# EAGLE design Full Sonar v1 opt corrected external clock (EAGLE 7.4.0)
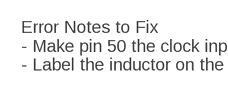
[diagram p0: schematic, sheet 1, part 1 of 2]
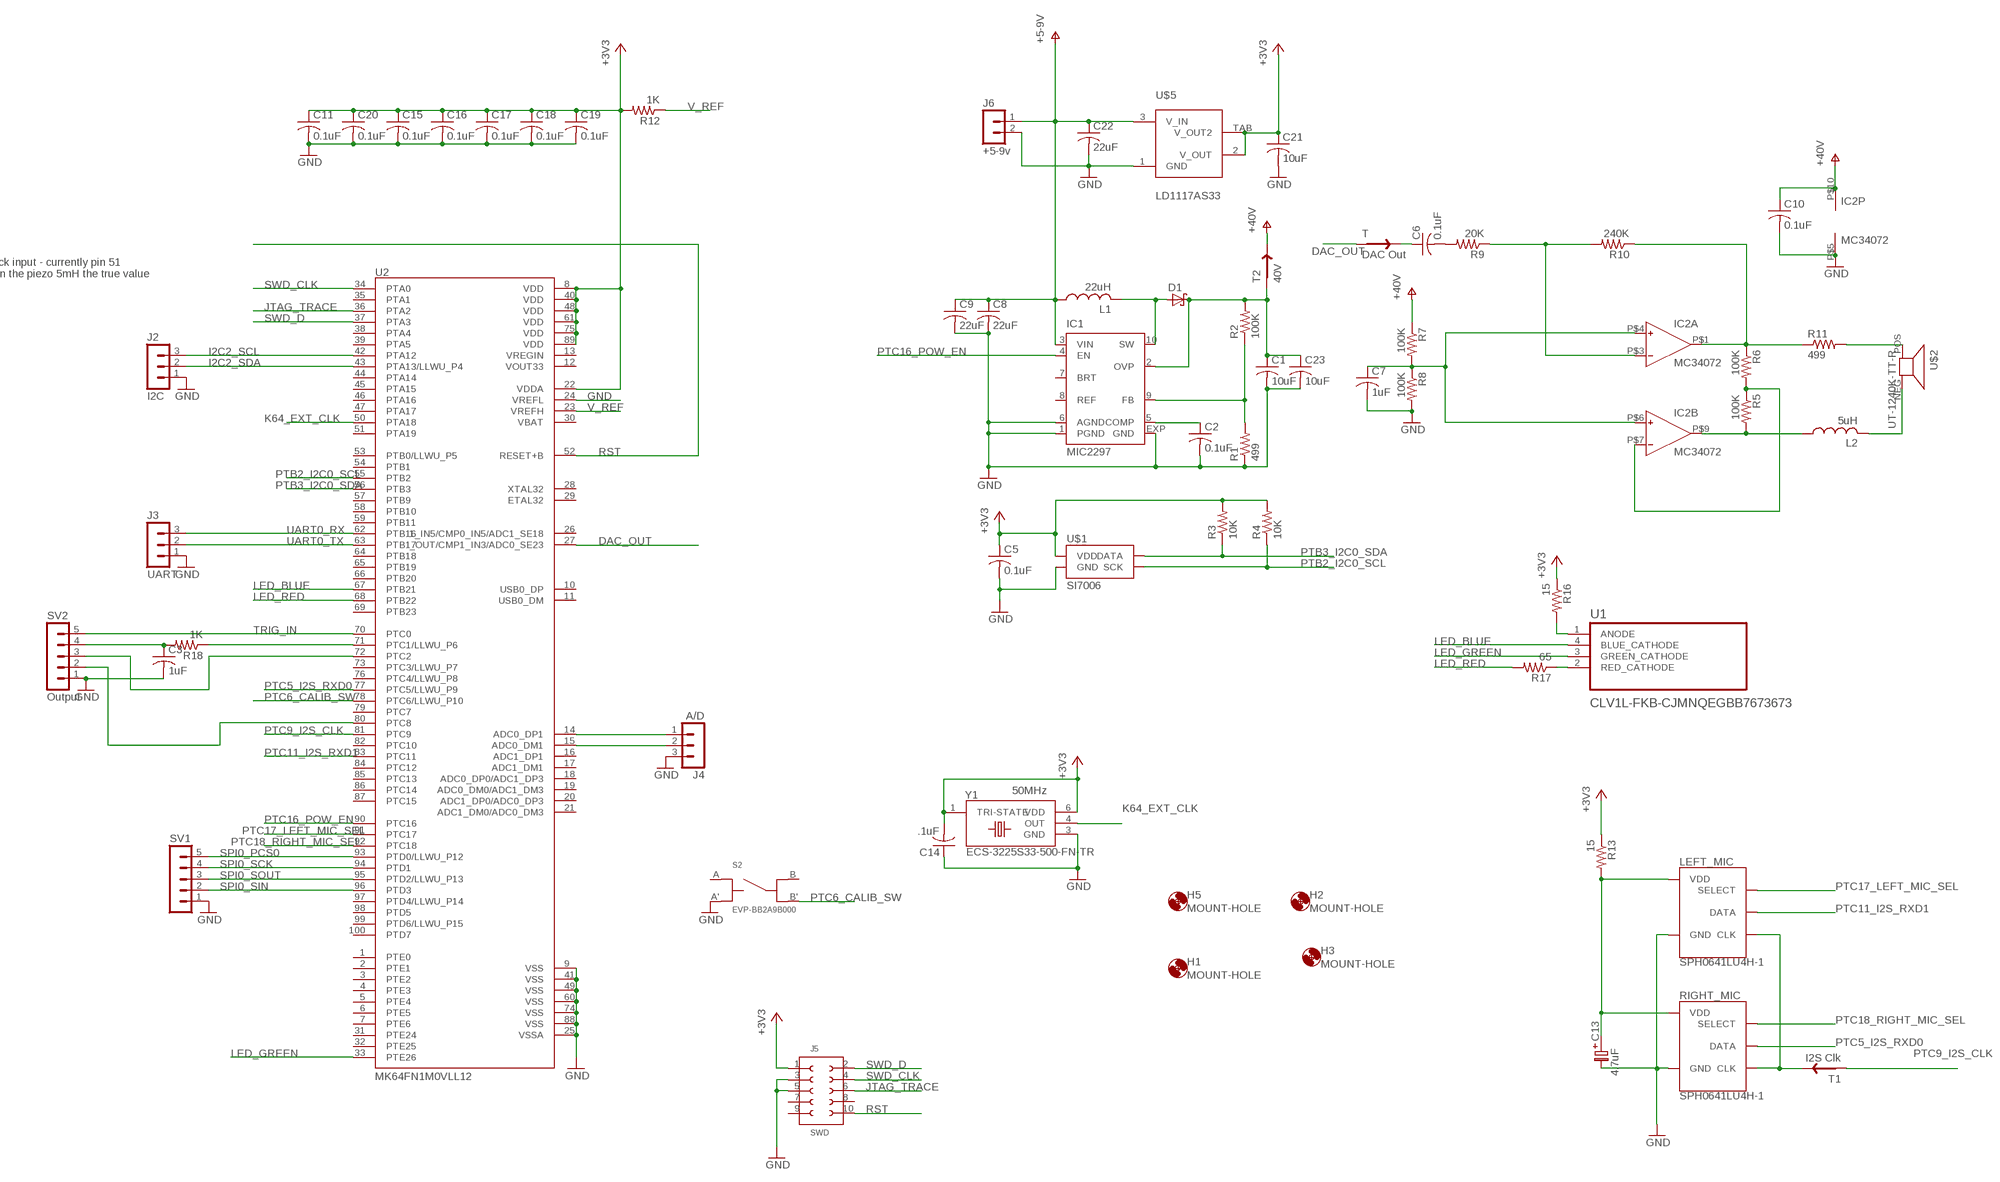
[diagram p1: schematic, sheet 1, part 2 of 2]

## Parts
C1  10uF  C-USC1206  [C1206]
C2  0.1uF  C-USC0603  [C0603]
C3  1uF  C-USC0603  [C0603]
C5  0.1uF  C-USC0603  [C0603]
C6  0.1uF  C-USC0603  [C0603]
C7  1uF  C-USC0603  [C0603]
C8  22uF  C-USC0805  [C0805]
C9  22uF  C-USC0805  [C0805]
C10  0.1uF  C-USC0603  [C0603]
C11  0.1uF  C-USC0603  [C0603]
C13  4.7uF  CPOLA  [TE-A-3216]
C14  .1uF  C-USC0603  [C0603]
C15  0.1uF  C-USC0603K  [C0603K]
C16  0.1uF  C-USC0603  [C0603]
C17  0.1uF  C-USC0603  [C0603]
C18  0.1uF  C-USC0603  [C0603]
C19  0.1uF  C-USC0603  [C0603]
C20  0.1uF  C-USC0603K  [C0603K]
C21  10uF  C-USC0603  [C0603]
C22  22uF  C-USC0805  [C0805]
C23  10uF  C-USC1206  [C1206]
D1  DIODE_SCHOTTKYMICROSMP  [DIODE_SCHOTTKY_MICROSMP]
H1  MOUNT-HOLE  [SCREWHOLE2-56]
H2  MOUNT-HOLE  [SCREWHOLE2-56]
H3  MOUNT-HOLE  [SCREWHOLE2-56]
H5  MOUNT-HOLE  [SCREWHOLE2-56]
IC1  MIC2297  [MLF10]
IC2  MC34072  [WQFN10]
J2  I2C  MA03-1  [MA03-1]
J3  UART  MA03-1  [MA03-1]
J4  A/D  MA03-1  [MA03-1]
J5  SWD  62201021121  [62201021121]
J6  +5-9v  MA02-1  [MA02-1]
L1  22uH  INDUCTOR7  [INDUCTOR_BOURNS_SRN3012TA]
L2  5uH  INDUCTOR  [INDUCTOR_BOURNS_SDR0503]
LEFT_MIC  SPH0641LU4H-1  [SPH0641LU4H-1]
R1  499  R-US_R0603  [R0603]
R2  100K  R-US_R0603  [R0603]
R3  10K  R-US_R0603  [R0603]
R4  10K  R-US_R0603  [R0603]
R5  100K  R-US_R0603  [R0603]
R6  100K  R-US_R0603  [R0603]
R7  100K  R-US_R0603  [R0603]
R8  100K  R-US_R0603  [R0603]
R9  20K  R-US_R0603  [R0603]
R10  240K  R-US_R0603  [R0603]
R11  499  R-US_R0603  [R0603]
R12  1K  R-US_R0603  [R0603]
R13  15  R-US_R0603  [R0603]
R16  15  R-US_R0603  [R0603]
R17  65  R-US_R0603  [R0603]
R18  1K  R-US_R0603  [R0603]
RIGHT_MIC  SPH0641LU4H-1  [SPH0641LU4H-1]
S2  EVP-BB2A9B000  [SW_EVP-BB2A9B000]
SV1  MA05-1  [MA05-1]
SV2  Output  MA05-1  [MA05-1]
T  DAC Out  TESTPAD""  [TESTPAD]
T1  I2S Clk  TESTPAD""  [TESTPAD]
T2  40V  TESTPAD""  [TESTPAD]
U1  CLV1L-FKB-CJMNQEGBB7673673  [SOJ150P350X372-4N]
U2  MK64FN1M0VLL12  [QFP50P1600X1600X170-100N]
U$1  SI7006  [SI7006]
U$2  UT-1240K-TT-R  [UT-1240K-TT-R]
U$5  LD1117AS33  [SOT223]
Y1  ECS-3225S33-500-FN-TR  [XTAL_ECS-3225S18-050-EN-TR]

## Nets
+3V3: C5.1 C11.1 C14.2 C15.1 C16.1 C17.1 C18.1 C19.1 C20.1 C21.1 J5.1 R3.2 R4.2 R12.2 R13.1 R16.1 U2.8(VDD) U2.22(VDDA) U2.40(VDD) U2.48(VDD) U2.61(VDD) U2.75(VDD) U2.89(VDD) U$1.VDD U$5.2(V_OUT) U$5.TAB(V_OUT2) Y1.1(TRI-STATE) Y1.6(VDD)
+5-9V: C8.1 C9.1 C22.1 IC1.3(VIN) J6.1 L1.P$1 U$5.3(V_IN)
+40V: C1.1 C23.1 D1.C IC1.2(OVP) R2.2 T2.IN
DAC_OUT: T.IN U2.27(_OUT/CMP1_IN3/ADC0_SE23)
GND: C1.2 C2.2 C3.2 C5.2 C7.2 C8.2 C9.2 C10.2 C11.2 C13.- C14.1 C15.2 C16.2 C17.2 C18.2 C19.2 C20.2 C21.2 C22.2 C23.2 IC1.1(PGND) IC1.6(AGND) IC1.EXP(GND) IC2.P$5(P:V-) J2.1 J3.1 J4.3 J5.3 J5.5 J6.2 LEFT_MIC.3(GND) R1.1 R8.2 RIGHT_MIC.3(GND) S2.A' SV1.1 SV2.1 U2.9(VSS) U2.24(VREFL) U2.25(VSSA) U2.41(VSS) U2.49(VSS) U2.60(VSS) U2.74(VSS) U2.88(VSS) U$1.GND U$5.1(GND) Y1.3(GND)
I2C2_SCL: J2.3 U2.42(PTA12)
I2C2_SDA: J2.2 U2.43(PTA13/LLWU_P4)
JTAG_TRACE: J5.6 U2.36(PTA2)
K64_EXT_CLK: U2.50(PTA18) Y1.4(OUT)
LED_BLUE: U1.4(BLUE_CATHODE) U2.67(PTB21)
LED_GREEN: U1.3(GREEN_CATHODE) U2.33(PTE26)
LED_RED: R17.2 U2.68(PTB22)
N$1: J4.1 U2.14(ADC0_DP1)
N$2: D1.A IC1.10(SW) L1.P$2
N$3: J4.2 U2.15(ADC0_DM1)
N$4: R16.2 U1.1(ANODE)
N$5: C2.1 IC1.5(COMP)
N$6: IC2.P$9(B:OUT) L2.1 R5.2
N$7: IC2.P$7(B:IN-) R5.1 R6.2
N$8: IC2.P$1(A:OUT) R6.1 R10.1 R11.1
N$9: IC1.9(FB) R1.2 R2.1
N$10: R11.2 U$2.POS
N$11: C7.1 IC2.P$4(A:IN+) IC2.P$6(B:IN+) R7.2 R8.1
N$12: IC2.P$3(A:IN-) R9.1 R10.2
N$13: C6.2 R9.2
N$14: L2.2 U$2.NEG
N$15: C6.1 T.OUT
N$17: LEFT_MIC.4(CLK) RIGHT_MIC.4(CLK) T1.OUT
N$18: C13.+ LEFT_MIC.5(VDD) R13.2 RIGHT_MIC.5(VDD)
N$20: R17.1 U1.2(RED_CATHODE)
N$21: R18.1 U2.71(PTC1/LLWU_P6)
N$22: C3.1 R18.2 SV2.4
N$23: SV2.3 U2.72(PTC2)
N$24: SV2.2 U2.80(PTC8)
PTB2_I2C0_SCL: R4.1 U2.55(PTB2) U$1.SCK
PTB3_I2C0_SDA: R3.1 U2.56(PTB3) U$1.DATA
PTC5_I2S_RXD0: RIGHT_MIC.1(DATA) U2.77(PTC5/LLWU_P9)
PTC6_CALIB_SW: S2.B' U2.78(PTC6/LLWU_P10)
PTC9_I2S_CLK: T1.IN U2.81(PTC9)
PTC11_I2S_RXD1: LEFT_MIC.1(DATA) U2.83(PTC11)
PTC16_POW_EN: IC1.4(EN) U2.90(PTC16)
PTC17_LEFT_MIC_SEL: LEFT_MIC.2(SELECT) U2.91(PTC17)
PTC18_RIGHT_MIC_SEL: RIGHT_MIC.2(SELECT) U2.92(PTC18)
RST: J5.10 U2.52(RESET+B)
SPI0_PCS0: SV1.5 U2.93(PTD0/LLWU_P12)
SPI0_SCK: SV1.4 U2.94(PTD1)
SPI0_SIN: SV1.2 U2.96(PTD3)
SPI0_SOUT: SV1.3 U2.95(PTD2/LLWU_P13)
SWD_CLK: J5.4 U2.34(PTA0)
SWD_D: J5.2 U2.37(PTA3)
TRIG_IN: SV2.5 U2.70(PTC0)
UART0_RX: J3.3 U2.62(PTB16)
UART0_TX: J3.2 U2.63(PTB17)
V+: C10.1 IC2.P$10(P:V+) R7.1 T2.OUT ; supply symbol labelled +40V
V_REF: R12.1 U2.23(VREFH)
Unconnected: IC1.7(BRT) IC1.8(REF) J5.7 J5.8 J5.9 S2.A S2.B U2.1(PTE0) U2.2(PTE1) U2.3(PTE2) U2.4(PTE3) U2.5(PTE4) U2.6(PTE5) U2.7(PTE6) U2.10(USB0_DP) U2.11(USB0_DM) U2.16(ADC1_DP1) U2.17(ADC1_DM1) U2.18(ADC0_DP0/ADC1_DP3) U2.19(ADC0_DM0/ADC1_DM3) U2.20(ADC1_DP0/ADC0_DP3) U2.21(ADC1_DM0/ADC0_DM3) U2.26(1_IN5/CMP0_IN5/ADC1_SE18) U2.28(XTAL32) U2.29(ETAL32) U2.31(PTE24) U2.32(PTE25) U2.35(PTA1) U2.38(PTA4) U2.39(PTA5) U2.44(PTA14) U2.45(PTA15) U2.46(PTA16) U2.47(PTA17) U2.51(PTA19) U2.53(PTB0/LLWU_P5) U2.54(PTB1) U2.57(PTB9) U2.58(PTB10) U2.59(PTB11) U2.64(PTB18) U2.65(PTB19) U2.66(PTB20) U2.69(PTB23) U2.73(PTC3/LLWU_P7) U2.76(PTC4/LLWU_P8) U2.79(PTC7) U2.82(PTC10) U2.84(PTC12) U2.85(PTC13) U2.86(PTC14) U2.87(PTC15) U2.97(PTD4/LLWU_P14) U2.98(PTD5) U2.99(PTD6/LLWU_P15) U2.100(PTD7)

## Notes on the sheet
- Error Notes to Fix
  - Make pin 50 the clock input - currently pin 51
  - Label the inductor on the piezo 5mH the true value
- 50MHz

## Power pins joined to a net without a drawn wire
VBAT: U2.30(VBAT)
VOUT33: U2.12(VOUT33)
VREGIN: U2.13(VREGIN)

## Library data of the parts
C1-C3 C5-C11 C14-C23 = rcl:C-US: CAPACITOR, American symbol
C13 = filip:CPOL: polarized SMD caps Size A 3.2x1.6, Size B 3.5x2.8, Size C 6.0x3.2, Size D (or N) 7.3x4.3 0805 United Chem E60 5x5.7, F60 6.3x5.7, H70 8x6.7 or HA0
D1 = filip:DIODE_SCHOTTKY: Schottky Power Rectifier
H1-H3 H5 = filip:MOUNT-HOLE: MOUNTING HOLE with drill center marker
IC1 = micrel:MIC2297: 40V PWM Boost Regulator White LED Driver Source: http://www.micrel.com/_PDF/mic2297.pdf; MPN: MIC2297-38YML TR; OC_FARNELL: 1663107; OC_NEWARK: 11R3489
IC2 = filip:MC34072: Dual Precision, Low Cost, High Speed Op Amp +44v supply
J2-J4 = filip:MA03-1: PIN HEADER; OC_FARNELL: unknown; OC_NEWARK: unknown
J5 = pin header 1.27 pitch 2 row 10 pin:62201021121: WR-PHD 1.27mm Dual Pin Header, 10 Pins=>Code : Con_BTB_PHD_1.27_2_62201021121 <http://katalog.we-online.de/media/thumbs2/eican/thb_Con_BTB_PHD_1.27_2_6220xx21121_pf2.jpg> Details see: http://katalog.we-online.de/en/em/622_0xx_211_21 Created 2014-06-03, Karrer Zheng 2014 (C) Würth Elektronik; AVAILABILITY: Good; DESCRIPTION: CONN HEADER VERT DUAL 10POS 1.27; MF: Würth Elektronik; MP: 62201021121; PACKAGE: None; PRICE: 0.94 USD
J6 = filip:MA02-1
L1 L2 = filip:INDUCTOR
LEFT_MIC RIGHT_MIC = filip:SPH0641LU4H-1: Knowles MEMS microphone - ultrasonic range
R1-R13 R16-R18 = rcl:R-US_: RESISTOR, American symbol
S2 = EVP-BB2A9B000:EVP-BB2A9B000: SWITCH TACTILE SPST-NO 0.02A 15V; AVAILABILITY: Good; DESCRIPTION: SWITCH TACTILE SPST-NO 0.02A 15V; MF: Panasonic Electronic; MP: EVP-BB2A9B000; PACKAGE: None; PRICE: 0.40 USD
SV1 SV2 = con-lstb:MA05-1: PIN HEADER; OC_FARNELL: unknown; OC_NEWARK: unknown
T T1 T2 = filip:TESTPAD
U1 = CLV1L-FKB-CJMNQEGBB7673673:CLV1L-FKB-CJMNQEGBB7673673: None; AVAILABILITY: Good; DESCRIPTION: LED RGB 4PLCC SMD; MF: Cree; MP: CLV1L-FKB-CJMNQEGBB7673673; PACKAGE: PLCC-4 Cree; PRICE: 0.22 USD
U2 = MK64FN1M0VLL12:MK64FN1M0VLL12: MCU 32-Bit K64F ARM Cortex M4 RISC 1MB Flash 1.8V/2.5V/3.3V 100-Pin LQFP Tray; AVAILABILITY: Unavailable; DESCRIPTION: IC MCU 32BIT 1MB FLASH 100LQFP; MF: NXP Semiconductors; MP: MK64FN1M0VLL12; PACKAGE: LQFP-100 NXP Semiconductors; PRICE: 10.49 USD
U$1 = filip:SI7006: The Si7006 is an I2C Humidity and Temperature Sensor; PROD_ID: IC-13093
U$2 = filip:UT-1240K-TT-R
U$5 = LD1117AS33:LD1117AS33; AVAILABILITY: Unavailable; DESCRIPTION: Power Management, pin, Linear Regulators, regulator, sot, Semiconductors and Actives; MF: STMicroelectronics; MP: LD1117AS33; PACKAGE: None; PRICE: None
Y1 = ECS-3225S33-500-FN-TR:ECS-3225S33-500-FN-TR: Miniature SMD HCMOS tight stability crystal oscillator; DESCRIPTION: OSC XO 50.0000MHZ HCMOS SMD; DIGI-KEY_PART_NUMBER: XC2226CT-ND; DIGI-KEY_PURCHASE_URL: https://www.digikey.com/product-detail/en/ecs-inc/ECS-3225S33-500-FN-TR/XC2226CT-ND/6578533?WT.z_cid=ref_snapeda&utm_source=snapeda&utm_medium=aggregator&utm_campaign=buynow; MF: ECS International; MP: ECS-3225S33-500-FN-TR; PACKAGE: SMD-6 ECS International

## Board
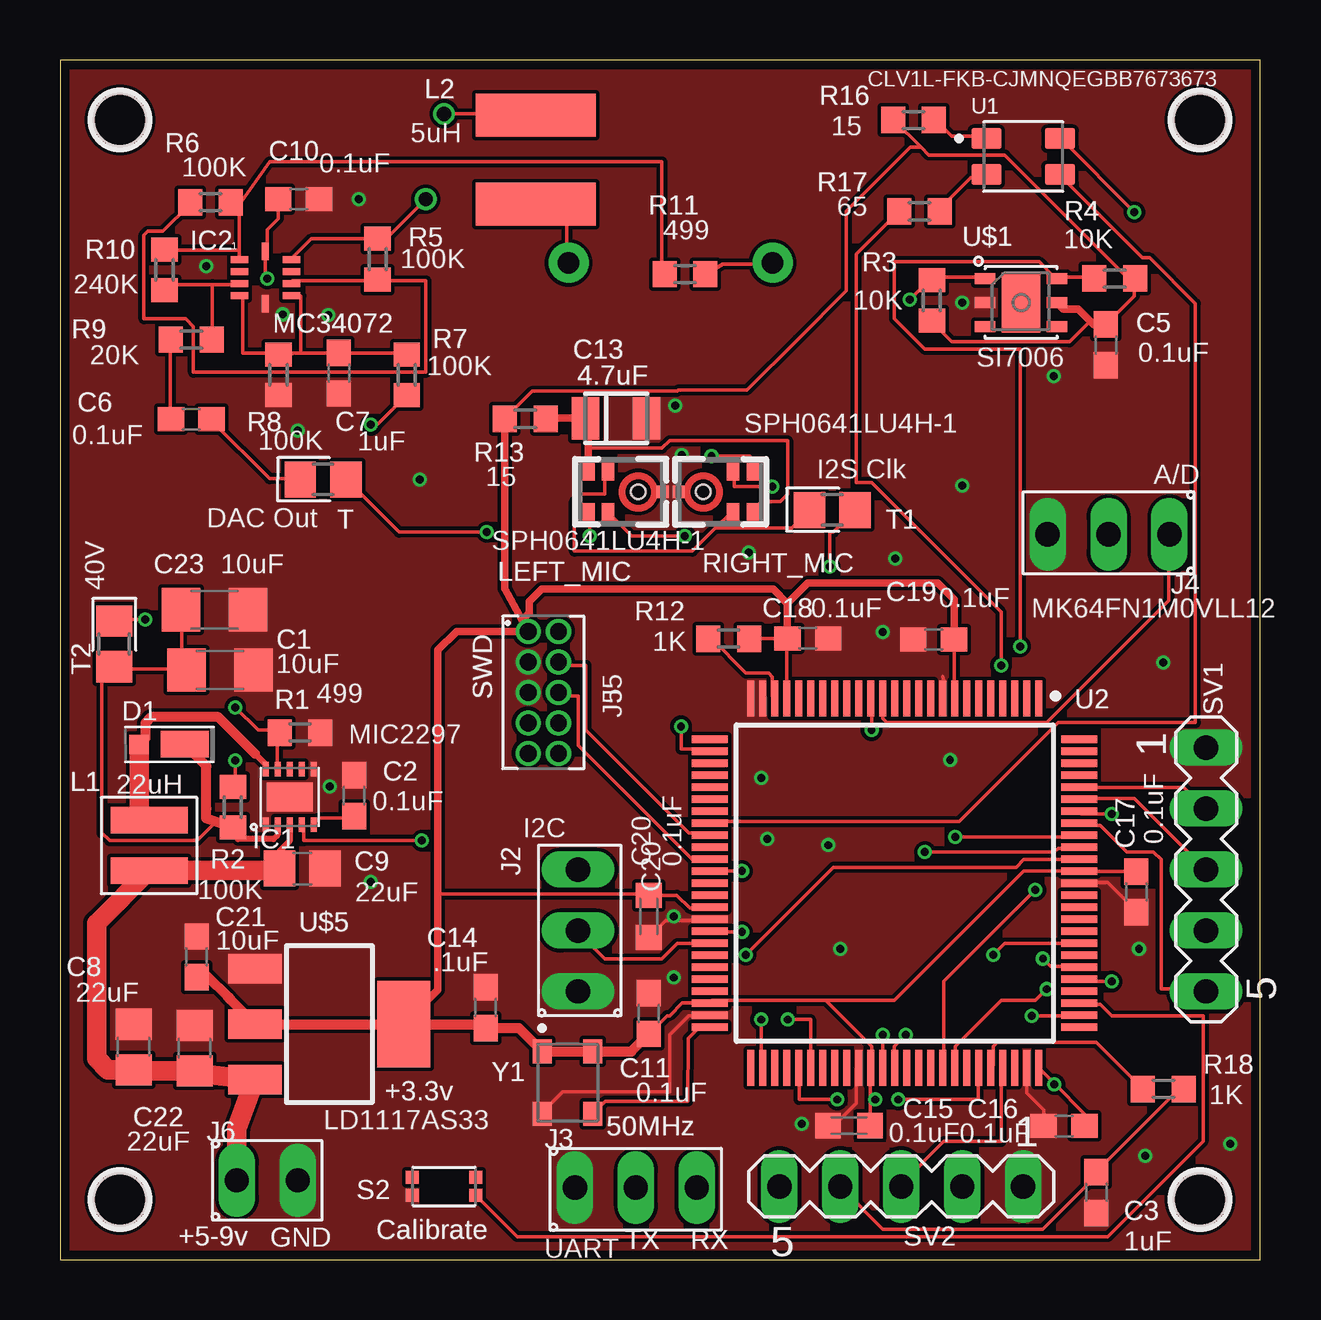
[diagram p2: board, top side]
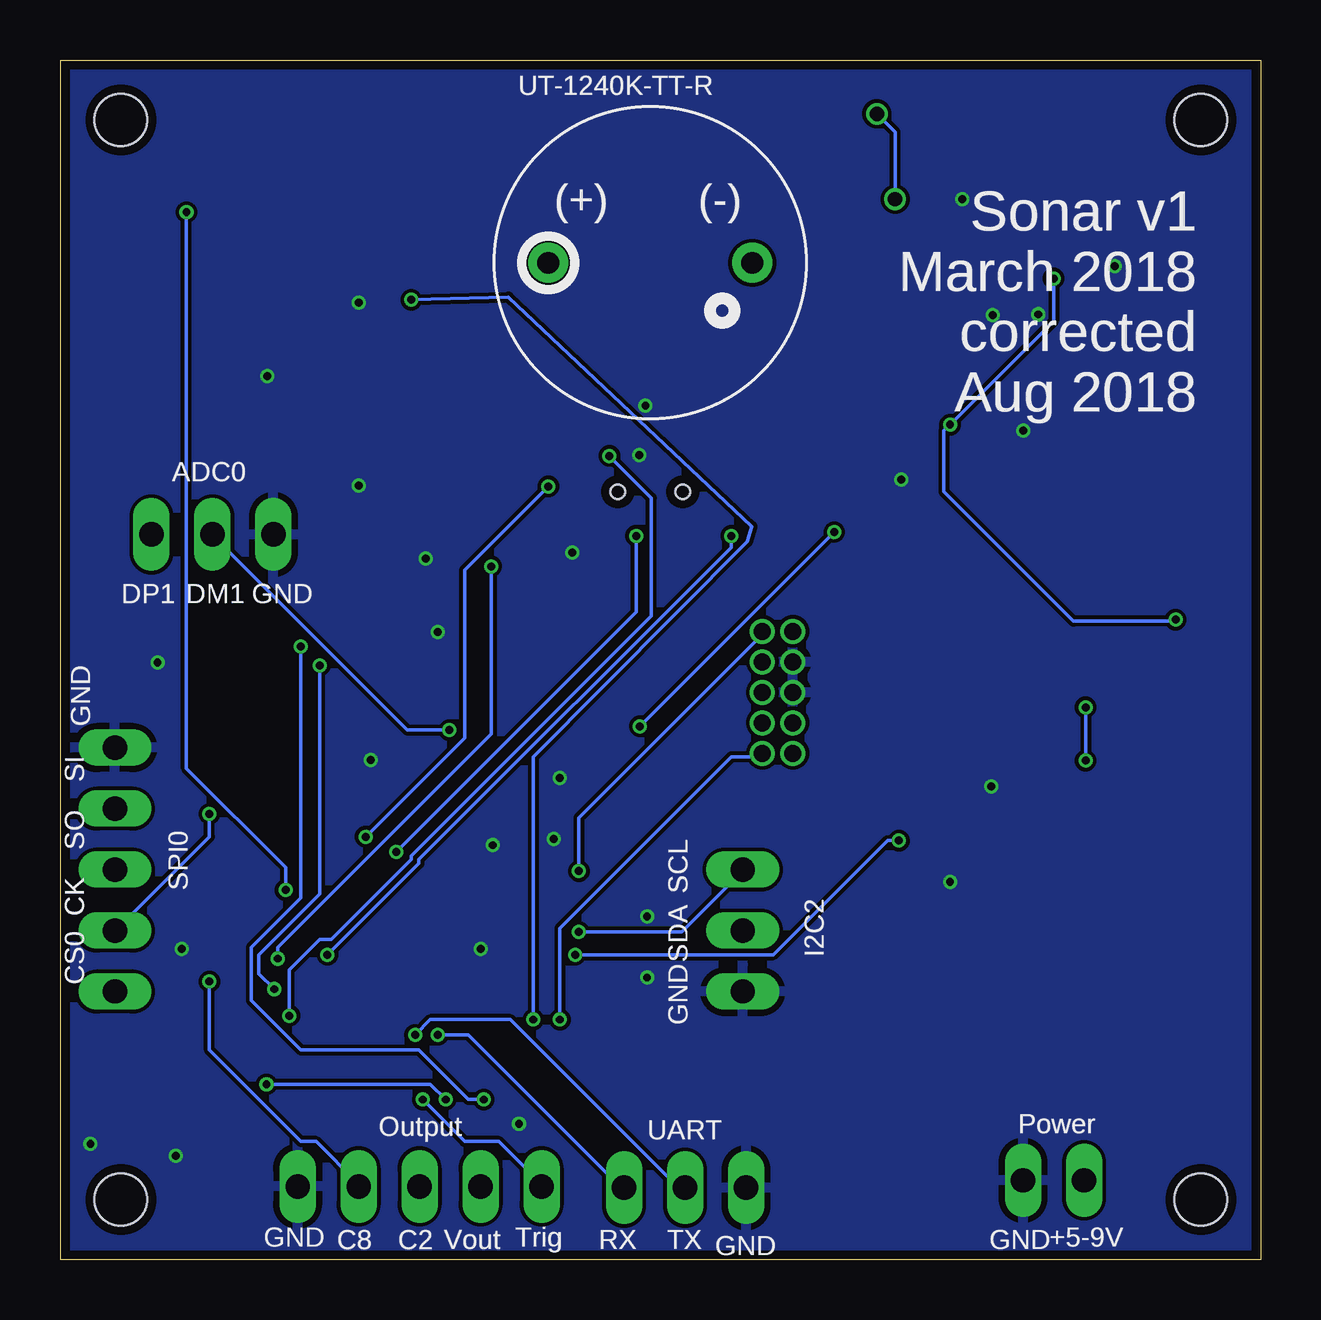
[diagram p3: board, bottom side, seen from below]

Size 50 x 50 mm. Coordinates in mm from the lower left corner, seen from the top.
Outline: 0,0 50,0 50,50 0,50 0,0
Copper layers (1*16): Top 0.035559375mm / dielectric 1.6mm / Bottom 0.035559375mm
Design rules "oshpark-2layer": minimum track width 6mil, minimum drill 10mil, track to track 6mil, track to pad 6mil, pad to pad 6mil, via to via 6mil, smd to smd 6mil, copper to edge 15mil, drill to drill 6mil, minimum pad ring 5mil, minimum via ring 5mil, stop-mask expansion 2.5mil, vias tented up to drill 0mil, thermal gap 10mil

### Footprints (pad centres in the part's own frame; a part is rotated, then mirrored left to right if it is on the bottom)
C1206 = smd 1.6 x 1.8: 1 -1.4,0; 2 1.4,0
C0603 = smd 1.1 x 1: 1 -0.85,0; 2 0.85,0
C0805 = smd 1.3 x 1.5: 1 -0.95,0; 2 0.95,0
TE-A-3216 = smd 1.143 x 1.778: + 1.27,0; - -1.27,0
C0603K = smd 1.05 x 1.08: 1 -0.875,0; 2 0.875,0
DIODE_SCHOTTKY_MICROSMP = smd 0.8 x 0.8: A 0.4,0 | smd 2 x 1.1: C -1.5,0
SCREWHOLE2-56 = hole 2.184: 0,0
MLF10 = smd 0.6 x 0.25: 1 -1.15,1; 2 -1.15,0.5; 3 -1.15,0; 4 -1.15,-0.5; 5 -1.15,-1; 6 1.15,-1; 7 1.15,-0.5; 8 1.15,0; 9 1.15,0.5; 10 1.15,1 | smd 1.2 x 1.9: EXP 0,0
WQFN10 = smd 0.73 x 0.3: P$1 -1.085,0.75; P$2 -1.085,0.25; P$3 -1.085,-0.25; P$4 -1.085,-0.75; P$6 1.085,-0.75; P$7 1.085,-0.25; P$8 1.085,0.25; P$9 1.085,0.75 | smd 0.3 x 0.73: P$5 0,-1.085; P$10 0,1.085
MA03-1 = drill 1.016 long: 1 -2.54,0; 2 0,0; 3 2.54,0
62201021121 = drill 0.7: 1 -2.54,-0.635; 2 -2.54,0.635; 3 -1.27,-0.635; 4 -1.27,0.635; 5 0,-0.635; 6 0,0.635; 7 1.27,-0.635; 8 1.27,0.635; 9 2.54,-0.635; 10 2.54,0.635
MA02-1 = drill 1.016 long: 1 -2.54,0; 2 0,0
INDUCTOR_BOURNS_SRN3012TA = smd 1.1 x 3.2: P$1 -1.05,0; P$2 1.05,0
INDUCTOR_BOURNS_SDR0503 = smd 1.8 x 5: 1 -1.85,0; 2 1.85,0
SPH0641LU4H-1 = smd 0.725 x 0.522: 1 -0.838,2.074; 2 -0.838,1.252; 4 0.838,1.252; 5 0.838,2.074 | smd 0.508 x 0.508: 3 0,-1.016 | hole 0.6: 0,0
R0603 = smd 1 x 1.1: 1 -0.85,0; 2 0.85,0
SW_EVP-BB2A9B000 = smd 0.55 x 0.55: A -1.325,0.375; A' -1.325,-0.375; B 1.325,0.375; B' 1.325,-0.375
MA05-1 = drill 1.016 long: 1 -5.08,0; 2 -2.54,0; 3 0,0; 4 2.54,0; 5 5.08,0
TESTPAD = smd 1.3 x 1.5: IN -0.944,0.029; OUT 0.956,0.029
SOJ150P350X372-4N = smd 1.26 x 0.89: 1 -1.535,0.75; 2 -1.535,-0.75; 3 1.535,-0.75; 4 1.535,0.75
QFP50P1600X1600X170-100N = smd 1.5 x 0.3: 1 -7.7,6; 2 -7.7,5.5; 3 -7.7,5; 4 -7.7,4.5; 5 -7.7,4; 6 -7.7,3.5; 7 -7.7,3; 8 -7.7,2.5; 9 -7.7,2; 10 -7.7,1.5; 11 -7.7,1; 12 -7.7,0.5; 13 -7.7,0; 14 -7.7,-0.5; 15 -7.7,-1; 16 -7.7,-1.5; 17 -7.7,-2; 18 -7.7,-2.5; 19 -7.7,-3; 20 -7.7,-3.5; 21 -7.7,-4; 22 -7.7,-4.5; 23 -7.7,-5; 24 -7.7,-5.5; 25 -7.7,-6; 51 7.7,-6; 52 7.7,-5.5; 53 7.7,-5; 54 7.7,-4.5; 55 7.7,-4; 56 7.7,-3.5; 57 7.7,-3; 58 7.7,-2.5; 59 7.7,-2; 60 7.7,-1.5; 61 7.7,-1; 62 7.7,-0.5; 63 7.7,0; 64 7.7,0.5; 65 7.7,1; 66 7.7,1.5; 67 7.7,2; 68 7.7,2.5; 69 7.7,3; 70 7.7,3.5; 71 7.7,4; 72 7.7,4.5; 73 7.7,5; 74 7.7,5.5; 75 7.7,6 | smd 0.3 x 1.5: 26 -6,-7.7; 27 -5.5,-7.7; 28 -5,-7.7; 29 -4.5,-7.7; 30 -4,-7.7; 31 -3.5,-7.7; 32 -3,-7.7; 33 -2.5,-7.7; 34 -2,-7.7; 35 -1.5,-7.7; 36 -1,-7.7; 37 -0.5,-7.7; 38 0,-7.7; 39 0.5,-7.7; 40 1,-7.7; 41 1.5,-7.7; 42 2,-7.7; 43 2.5,-7.7; 44 3,-7.7; 45 3.5,-7.7; 46 4,-7.7; 47 4.5,-7.7; 48 5,-7.7; 49 5.5,-7.7; 50 6,-7.7; 76 6,7.7; 77 5.5,7.7; 78 5,7.7; 79 4.5,7.7; 80 4,7.7; 81 3.5,7.7; 82 3,7.7; 83 2.5,7.7; 84 2,7.7; 85 1.5,7.7; 86 1,7.7; 87 0.5,7.7; 88 0,7.7; 89 -0.5,7.7; 90 -1,7.7; 91 -1.5,7.7; 92 -2,7.7; 93 -2.5,7.7; 94 -3,7.7; 95 -3.5,7.7; 96 -4,7.7; 97 -4.5,7.7; 98 -5,7.7; 99 -5.5,7.7; 100 -6,7.7
SI7006 = smd 0.85 x 0.45: DATA 1.5,-1; GND 1.5,0; NC@3 1.5,1; NC@4 -1.5,1; SCK -1.5,-1; VDD -1.5,0 | smd 1.6 x 2.5: P$1 0,0
UT-1240K-TT-R = drill 0.9 pad 1.676: NEG 4.25,0; POS -4.25,0
SOT223 = smd 1.219 x 2.235: 1 -2.311,-3.099; 2 0,-3.099; 3 2.311,-3.099 | smd 3.6 x 2.2: TAB 0,3.099
XTAL_ECS-3225S18-050-EN-TR = smd 1 x 0.8: 1 -1.3,-1.05; 3 1.3,-1.05; 4 1.3,1.05; 6 -1.3,1.05

### Placement (x,y rotation side)
C1  6.67,24.57 0 top
C2  12.26,19.33 90 top
C3  43.18,2.79 270 top
C5  43.57,38.12 270 top
C6  5.47,35.03 180 top
C7  11.62,36.94 270 top
C8  3.06,8.86 90 top
C9  10.09,16.29 0 top
C10  9.95,44.19 0 top
C11  24.54,10.25 90 top
C13  23.17,35.06 180 top
C14  17.73,10.5 270 top
C15  32.88,5.58 180 top
C16  41.84,5.57 180 top
C17  44.85,15.32 270 top
C18  31.16,25.88 0 top
C19  36.4,25.85 180 top
C20  24.53,14.31 270 top
C21  5.69,12.62 90 top
C22  5.61,8.81 90 top
C23  6.43,27.08 0 top
D1  3.69,21.47 180 top
H1  47.5,2.5 0 top
H2  2.5,47.5 0 top
H3  47.5,47.5 0 top
H5  2.5,2.5 0 top
IC1  9.57,19.28 90 top
IC2  8.56,40.93 0 top
J2  21.59,13.72 90 top
J3  23.99,2.99 0 top
J4  43.69,30.23 180 top
J5  20.14,23.64 270 top
J6  9.91,3.3 0 top
L1  3.72,17.26 90 top
L2  19.83,45.85 270 top
LEFT_MIC  24.09,32 90 top
R1  10,21.96 180 top
R2  7.21,18.85 270 top
R3  36.33,39.98 270 top
R4  43.94,40.89 0 top
R5  13.23,41.7 90 top
R6  6.27,44.07 180 top
R7  14.45,36.87 90 top
R8  9.11,36.87 270 top
R9  5.47,38.34 180 top
R10  4.35,41.25 270 top
R11  26.04,41.07 0 top
R12  27.86,25.88 0 top
R13  19.39,35.04 0 top
R16  35.56,47.5 0 top
R17  35.81,43.69 180 top
R18  45.97,7.11 0 top
RIGHT_MIC  26.8,32 270 top
S2  16,3.05 0 top
SV1  47.75,16.26 270 top
SV2  35.05,3.05 180 top
T  10.97,32.55 180 top
T1  32.18,31.28 180 top
T2  2.29,25.65 90 top
U1  40.13,45.97 0 top
U2  34.78,15.69 270 top
U$1  40.05,39.89 180 top
U$2  25.44,41.55 0 bottom
U$5  11.22,9.81 270 top
Y1  21.15,7.38 270 top

### Tracks (layer width: path | path; a pad name or v marks a point on that pad's centre or on a via)
+3V3  (via drill 0.33)
  Top 0.152: C15.1 33.75,6.67 | 33.75,6.67 33.75,7.97 U2.61 33.81,8.1 33.81,8.89 31.91,10.79 | C16.1 42.69,6.08 41.45,7.32 | 41.45,7.32 U2.75 | C17.1 42.5,16.17 U2.89 42.39,16.19 40.16,16.19 34.77,10.79 31.91,10.79 | C19.1 37.25,23.41 U2.8 | U2.22 30.28,25.85 C18.1 R12.2 | R12.2 | C11.1 25.29,10.16 25.4,10.16 25.93,10.69 U2.48 27.15,10.79 31.91,10.79 | U2.40 27.04,14.65 26.23,14.65 25.71,15.18 C20.1 24.45,15.24 15.75,15.24 | 42.93,39.12 42.07,38.26 37.15,38.26 36.35,39.05 R3.2 | 35.88,46.35 36.2,46.04 39.37,46.04 44.45,40.96 44.77,40.96 R4.2 44.77,40.8 44.77,40.16 43.66,39.05 C5.1 | 35.88,46.35 34.77,47.47 R16.1 | 33.75,6.67 v33.97,6.67 | v41.43,7.3 41.45,7.32 | R13.1 18.57,35.08 19.68,36.2 25.72,36.2 25.77,36.24 28.62,36.24 30.73,38.35 | 35.88,46.35 35.43,46.35 32.77,43.69 32.77,40.39 30.73,38.35 | 30.73,38.35
  Top 0.305: R13.1 18.54,27.97 19.25,26.64 | 19.25,26.64 J5.1 16.53,26.18 15.75,25.4 15.75,15.24 15.75,11.24 U$5.TAB | C18.1 30.31,27.35 | 30.31,27.35 29.72,27.94 20.07,27.94 19.56,27.43 19.56,26.95 19.25,26.64 | C19.1 37.25,27.52 36.58,28.19 31.16,28.19 30.31,27.35 | C5.1 43.07,38.97 42.93,39.12 42.42,39.62 41.81,39.62 U$1.VDD
  Top 0.406: C21.1 6.13,11.81 6.98,10.96 7.11,10.82 U$5.2 U$5.TAB 17.57,9.81 C14.2 19.12,9.65 Y1.1 Y1.6 23.81,8.68 C11.1
  Bottom 0.152: v41.43,7.3 34.61,7.3 v33.97,6.67
+5-9V
  Top 0.254: C9.1 9.14,17.02 9.57,17.45 IC1.3
  Top 0.813: J6.1 7.37,5.46 U$5.3 5.72,7.75 5.59,7.87 | 5.59,7.87 C22.1 | 5.59,7.87 3.1,7.87 C8.1 2,7.91 1.52,8.38 1.52,14.02 L1.P$1 9.06,16.21 C9.1
+40V
  Top 0.152: 5.08,24.61 5.24,24.61 C1.1 5.08,24.61 | 5.08,24.61 2.38,24.61 T2.IN 2.22,24.61 1.75,24.61 1.75,17.78 2.06,17.46 5.71,17.46 6.35,18.1 6.41,18.28 | 5.08,24.61 5.08,26.99 C23.1 5.08,27.15 5.56,27.15
  Top 0.254: IC1.2 9.07,17.71 8.89,17.53 7.43,17.53 R2.2
  Top 0.406: R2.2 6.41,18.28 6.09,18.39 6.1,18.8 6.1,20.57 D1.C
DAC_OUT  (via drill 0.33)
  Top 0.152: v17.78,30.32 14.13,30.32 12.06,32.38 T.IN | v25.88,22.23 25.88,21.27 26.99,21.27 U2.27
  Bottom 0.152: v25.88,22.23 v17.78,30.32
GND  (via drill 0.33)
  Top 0.152: C16.2 40.98,6.24 40.28,6.95 U2.74 | U2.49 26.99,10.16 26.19,10.16 25.4,9.37 25.4,6.99 20.95,6.99 20.16,6.19 Y1.3 | U2.41 26.99,14.13 25.24,14.13 24.61,13.49 C20.2 | U2.60 33.18,7.94 33.18,6.51 32.38,5.71 32.07,5.71 C15.2 | U2.88 42.55,15.72 43.66,15.72 44.77,14.61 C17.2 | U2.9 36.83,23.5 36.83,24.13 36.78,24.29
  other vias: 32.51,12.95 32,17.27 29.46,17.53 37.08,20.83 29.21,20.07 34.29,26.16 37.59,32.26 45.97,24.89 14.99,32.51 9.91,34.54 28.7,29.46 34.8,29.21 25.91,33.53 25.64,35.59 41.4,36.83 37.59,39.88 12.95,15.75 11.23,19.73 48.77,4.83 45.21,4.32 12.45,44.2 11.18,39.37 6.1,41.4 9.28,39.4 44.96,12.95 25.58,11.75 25.58,14.3 30.91,5.65
  pour Bottom: 0,0 50,0 50,50 0,50
  pour Top (no thermals): 24.7,0 50,0 50,50 0,50 0,0 21.8,0 21.8,0.1
I2C2_SCL  (via drill 0.33)
  Top 0.152: v28.42,13.65 27.15,13.65 U2.42
  Bottom 0.152: v28.42,13.65 24.13,13.65 21.59,16.19 J2.3
I2C2_SDA
  Top 0.152: U2.43 26.99,13.18 25.72,13.18 25.08,12.54 22.7,12.54 21.59,13.65 J2.2
JTAG_TRACE
  Top 0.152: U2.36 26.99,16.67 26.35,16.67 21.59,21.43 21.59,23.5 20.8,23.5 J5.6
K64_EXT_CLK
  Top 0.152: Y1.4 22.73,6.6 26.16,6.6 26.18,9.22 26.65,9.69 U2.50
LED_BLUE  (via drill 0.33)
  Top 0.152: v44.77,43.66 41.75,46.67 U1.4 | v40.64,15.4 36.83,11.59 36.83,8.1 U2.67
  Bottom 0.152: v44.77,43.66 44.77,20.48 40.64,16.35 v40.64,15.4
LED_GREEN
  Top 0.152: U1.3 41.75,45.09 45.09,41.75 45.4,41.75 47.31,39.85 47.31,22.38 41.59,22.38 37.47,18.26 27.15,18.26 U2.33
LED_RED  (via drill 0.33)
  Top 0.152: v39.21,24.77 39.21,26.99 33.81,32.38 33.18,32.38 33.18,41.91 34.92,43.66 R17.2 | v41.12,11.27 40.64,10.79 39.21,10.79 37.31,8.89 37.31,8.1 U2.68
  Bottom 0.152: v39.21,24.77 39.21,15.24 41.75,12.7 41.75,11.91 v41.12,11.27
N$1
  Top 0.152: U2.14 34.29,23.34 34.29,22.54 34.45,22.38 41.12,22.38 46.2,27.46 46.2,30.16 J4.1
N$2
  Top 0.254: IC1.10 8.57,20.64 8.13,21.08
  Top 0.406: 8.13,21.08 6.6,22.61 3.81,22.61 3.56,22.35 3.56,21.74 D1.A
  Top 0.813: D1.A 3.29,18.73 L1.P$2
N$3  (via drill 0.33)
  Top 0.152: v33.81,22.07 33.81,23.34 U2.15
  Bottom 0.152: v33.81,22.07 35.56,22.07 43.66,30.16 J4.2
N$4
  Top 0.152: R16.2 36.51,47.47 37.15,46.83 38.58,46.83 U1.1
N$5
  Top 0.152: IC1.5 10.64,18.26 10.79,18.41 12.22,18.41 C2.1
N$6  (via drill 0.6)
  Top 0.152: IC2.P$9 9.68,41.75 10.48,42.55 13.18,42.55 R5.2 13.34,42.55 13.59,42.55 v15.24,44.2 | 19.84,47.62 L2.1 19.77,47.75 v16,47.75
  Bottom 0.152: v15.24,44.2 15.24,46.99 v16,47.75
N$7
  Top 0.152: IC2.P$7 9.68,40.8 13.18,40.8 R5.1 13.34,40.8 15.24,40.8 15.24,36.99 5.56,36.99 5.56,38.89 5.24,39.21 3.49,39.21 3.49,42.7 3.65,42.86 4.29,42.86 5.4,43.97 R6.2
N$8
  Top 0.152: 7.46,43.97 7.46,42.07 | 7.46,42.07 7.46,41.75 IC2.P$1 | 7.46,43.97 7.14,43.97 R6.1 7.46,43.97 | 7.46,43.97 8.73,45.75 25.08,45.75 25.08,41.12 R11.1 | 7.46,42.07 4.45,42.07 R10.1
N$9  (via drill 0.33)
  Top 0.152: IC1.9 9.05,20.48 9.05,21.91 R1.2 9.05,22.07 8.26,22.07 v7.3,23.02 | v7.3,20.8 7.3,19.84 R2.1
  Bottom 0.152: v7.3,23.02 v7.3,20.8
N$10
  Top 0.152: R11.2 26.99,41.12 27.62,41.5 29.69,41.5 U$2.POS
N$11
  Top 0.152: IC2.P$4 7.62,40.16 7.62,37.78 9.05,37.78 R8.1 | 10.03,37.78 10.03,40.16 IC2.P$6 | 10.03,37.78 9.21,37.78 R8.1 | 10.03,37.78 11.59,37.78 C7.1 11.75,37.78 14.29,37.78 R7.2 | 10.03,37.78 R8.1
N$12
  Top 0.152: 6.35,40.64 4.6,40.64 4.45,40.48 R10.2 | 6.35,40.64 7.46,40.64 IC2.P$3 | 6.35,40.64 6.35,38.42 R9.1
N$13
  Top 0.152: C6.2 4.6,35.08 4.6,38.26 R9.2
N$14
  Top 0.152: U$2.NEG 21.11,41.91 21.11,43.97 19.84,43.97 L2.2
N$15
  Top 0.152: C6.1 6.35,34.92 8.73,32.54 10,32.54 T.OUT
N$17
  Top 0.152: 27.3,30.48 27.94,31.11 RIGHT_MIC.4 | 27.3,30.48 26.35,29.53 21.43,29.53 21.43,31.59 21.75,31.91 22.7,31.91 22.7,32.7 LEFT_MIC.4 | 27.3,30.48 30.48,30.48 31.11,31.11 T1.OUT
N$18
  Top 0.152: 22.02,33.81 25.08,33.81 25.4,34.13 30.32,34.13 30.32,31.91 30,31.59 29.21,31.59 28.89,31.27 RIGHT_MIC.5
  Top 0.305: LEFT_MIC.5 22.02,33.81 22.02,34.95 C13.+ 20.26,35.06 R13.2
N$20
  Top 0.152: R17.1 36.67,43.81 37.94,45.09 38.58,45.09 U1.2
N$21
  Top 0.152: R18.1 45.09,7.14 43.18,9.05 39.05,9.05 38.89,8.89 38.89,8.1 U2.71
N$22
  Top 0.152: R18.2 46.67,6.99 46.51,6.99 43.18,3.65 C3.1 43.18,3.49 40.96,1.27 34.29,1.27 SV2.4
N$23
  Top 0.152: U2.72 39.21,7.94 39.21,4.92 36.83,4.92 35.08,3.17 SV2.3
N$24  (via drill 0.33)
  Top 0.152: v43.81,11.59 42.55,11.59 U2.80
  Bottom 0.152: v43.81,11.59 43.81,8.73 40.01,4.92 39.37,4.92 37.62,3.17 SV2.2
PTB2_I2C0_SCL  (via drill 0.33)
  Top 0.152: R4.1 43.02,40.96 41.59,40.96 U$1.SCK 41.43,40.96 40.8,41.59 34.77,41.59 34.77,39.21 36.04,37.94 40.01,37.94 v40.01,25.56 | v32.38,6.67 30.8,6.67 30.8,7.94 U2.55
  Bottom 0.152: v32.38,6.67 33.02,6.67 35.08,8.73 40.01,8.73 42.07,10.79 42.07,13.02 40.01,15.08 v40.01,25.56
PTB3_I2C0_SDA  (via drill 0.33)
  Top 0.152: U$1.DATA 38.42,40.96 36.35,40.96 R3.1 36.2,40.8 v35.4,40.01 | v30.32,10 31.27,10 31.27,8.1 U2.56
  Bottom 0.152: v30.32,10 30.32,20.95 21.4,29.92 21.21,30.56 31.36,40.12 v35.4,40.01
PTC5_I2S_RXD0  (via drill 0.33)
  Top 0.152: v27.15,33.5 28.73,33.5 28.73,32.86 RIGHT_MIC.1 | v40.48,10.16 42.39,10.16 U2.77
  Bottom 0.152: v27.15,33.5 25.4,31.75 25.4,26.83 35.4,16.83 35.4,16.67 38.73,13.34 39.21,13.34 40.48,12.06 v40.48,10.16
PTC6_CALIB_SW
  Top 0.152: S2.B' 17.46,2.54 19.05,0.95 43.66,0.95 47.62,4.92 47.62,10.16 43.81,10.16 43.34,10.64 42.55,10.64 U2.78
PTC9_I2S_CLK  (via drill 0.33)
  Top 0.152: v40.96,12.54 41.27,12.22 42.39,12.22 U2.81 | v32.07,28.89 32.07,30.32 32.23,30.32 33.02,31.11 T1.IN
  Bottom 0.152: v40.96,12.54 40.96,13.02 32.07,21.91 v32.07,28.89
PTC11_I2S_RXD1  (via drill 0.33)
  Top 0.152: v22.07,30.16 22.07,31.11 LEFT_MIC.1 | v38.89,12.7 39.37,13.18 42.39,13.18 U2.83
  Bottom 0.152: v22.07,30.16 22.07,29.69 35.08,16.67 35.08,16.51 v38.89,12.7
PTC16_POW_EN  (via drill 0.33)
  Top 0.152: v15.08,17.46 10.16,17.46 10.16,18.1 IC1.4 | v28.57,12.7 32.23,16.35 39.85,16.35 40.16,16.67 42.39,16.67 U2.90
  Bottom 0.152: v15.08,17.46 15.56,17.46 20.32,12.7 v28.57,12.7
PTC17_LEFT_MIC_SEL  (via drill 0.33)
  Top 0.152: v26.04,30.16 23.81,30.16 22.86,31.11 LEFT_MIC.2 | v36.04,16.99 41.43,16.99 41.59,17.14 42.39,17.14 U2.91
  Bottom 0.152: v26.04,30.16 26.04,26.99 v36.04,16.99
PTC18_RIGHT_MIC_SEL  (via drill 0.33)
  Top 0.152: v29.69,32.23 28.1,32.23 28.1,32.7 RIGHT_MIC.2 | v37.31,17.62 42.39,17.62 U2.92
  Bottom 0.152: v29.69,32.23 33.18,28.73 33.18,21.75 v37.31,17.62
RST  (via drill 0.33)
  Top 0.152: v29.21,10 29.21,8.1 U2.52
  Bottom 0.152: v29.21,10 29.21,13.81 22.07,20.95 20.8,20.95 J5.10
SPI0_PCS0
  Top 0.152: U2.93 42.55,18.1 43.34,18.1 44.45,16.99 45.56,16.99 45.88,16.67 45.88,11.27 47.62,11.27 SV1.5
SPI0_SCK  (via drill 0.33)
  Top 0.152: v43.81,18.57 42.55,18.57 U2.94
  Bottom 0.152: v43.81,18.57 43.81,17.62 47.62,13.81 SV1.4
SPI0_SIN
  Top 0.152: U2.96 42.55,19.68 46.83,19.68 47.62,18.89 SV1.2
SPI0_SOUT
  Top 0.152: U2.95 42.55,19.21 44.77,19.21 47.62,16.35 SV1.3
SWD_CLK
  Top 0.152: U2.34 26.99,17.78 26.19,17.78 21.91,22.07 21.91,24.77 20.8,24.77 J5.4
SWD_D  (via drill 0.33)
  Top 0.152: v28.42,16.19 27.15,16.19 U2.37
  Bottom 0.152: v28.42,16.19 28.42,18.41 20.8,26.04 J5.2
TRIG_IN  (via drill 0.33)
  Top 0.152: v34.92,6.67 38.26,6.67 38.26,7.94 U2.70
  Bottom 0.152: v34.92,6.67 33.18,4.92 31.75,4.92 30,3.17 SV2.5
UART0_RX  (via drill 0.33)
  Top 0.152: v34.29,9.37 34.29,8.1 U2.62
  Bottom 0.152: v34.29,9.37 33.02,9.37 26.67,3.02 J3.3
UART0_TX  (via drill 0.33)
  Top 0.152: v35.24,9.37 34.77,8.89 34.77,8.1 U2.63
  Bottom 0.152: v35.24,9.37 34.61,10 31.27,10 24.13,2.86 J3.2
V+  (via drill 0.33)
  Top 0.152: 14.29,35.88 R7.1 13.22,34.8 v12.95,34.8 | T2.OUT 2.38,26.67 v3.56,26.67 | C10.1 9.1,43.39 8.64,42.93 8.64,42.09 IC2.P$10 8.56,40.97 v8.64,40.89
  Bottom 0.152: v8.64,40.89 8.64,39.12 v12.95,34.8 13.21,34.54 13.21,32 7.81,26.61 3.62,26.61 v3.56,26.67
V_REF
  Top 0.152: R12.1 27.15,25.88 28.57,24.45 29.53,24.45 29.69,24.29 29.69,23.5 U2.23

### Text on the board
tNames: +3.3v | 50MHz | Calibrate | GND | TX | RX
bNames: Sonar v1 / March 2018 / corrected / Aug 2018 | ADC0 | GND | DM1 | DP1 | GND | SI | SO | SPI0 | SCL | CK | I2C2 | SDA | CS0 | GND | Power | UART | +5-9V | GND | GND | TX | RX | Trig | Vout | C2 | C8 | GND
_tsilk: CLV1L-FKB-CJMNQEGBB7673673 | L2 | R16 | U1 | 5uH | 15 | R6 | C10 | 100K | 0.1uF | R17 | R11 | 65 | R4 | IC2 | R5 | 499 | U$1 | 10K | R10 | 1 | 100K | R3 | 240K | 10K | R9 | MC34072 | R7 | C5 | 20K | 100K | C13 | SI7006 | 4.7uF | 0.1uF | C6 | 0.1uF | R8 | C7 | 100K | 1uF | SPH0641LU4H-1 | R13 | I2S Clk | A/D | 15 | DAC Out | T | T1 | SPH0641LU4H-1 | C23 | 10uF | LEFT_MIC | RIGHT_MIC | J4 | 40V | C19 | 0.1uF | R12 | C18 | 0.1uF | MK64FN1M0VLL12 | C1 | SWD | 10uF | 1K | SV1 | T2 | R1 | 499 | J5 | D1 | U2 | MIC2297 | 1 | C2 | L1 | 22uH | 0.1uF | C17 | I2C | IC1 | 0.1uF | R2 | C9 | J2 | C20 | 0.1uF | 100K | C21 | 22uF | 10uF | U$5 | C8 | C14 | 22uF | .1uF | 5 | C11 | R18 | +3.3v | Y1 | 0.1uF | C15 | C16 | C22 | 50MHz | 0.1uF | 0.1uF | 1 | 1K | 22uF | J6 | LD1117AS33 | J3 | S2 | Calibrate | C3 | +5-9v | GND | TX | RX | 5 | SV2 | UART | 1uF
_bsilk: UT-1240K-TT-R | Sonar v1 / March 2018 / corrected / Aug 2018 | (-) | (+) | ADC0 | GND | DM1 | DP1 | GND | SI | SO | SPI0 | SCL | CK | I2C2 | SDA | CS0 | GND | Power | Output | UART | +5-9V | GND | GND | TX | RX | Trig | Vout | C2 | C8 | GND